# Altium project Service_board.PrjPcb (part 3 of 9)

## Sheet Channel.SchDoc
size A4; DocumentNumber: 3; SheetNumber: 3; SheetTotal: 10
Used 24 times, as channels U_Bank/U_Channel, U_Bank/U_Channel, U_Bank/U_Channel, U_Bank/U_Channel, U_Bank/U_Channel, U_Bank/U_Channel, U_Bank/U_Channel, U_Bank/U_Channel, U_Bank/U_Channel, U_Bank/U_Channel, U_Bank/U_Channel, U_Bank/U_Channel, U_Bank/U_Channel, U_Bank/U_Channel, U_Bank/U_Channel, U_Bank/U_Channel, U_Bank/U_Channel, U_Bank/U_Channel, U_Bank/U_Channel, U_Bank/U_Channel, U_Bank/U_Channel, U_Bank/U_Channel, U_Bank/U_Channel, U_Bank/U_Channel. Parts and nets are listed once, with the designators drawn on the sheet.
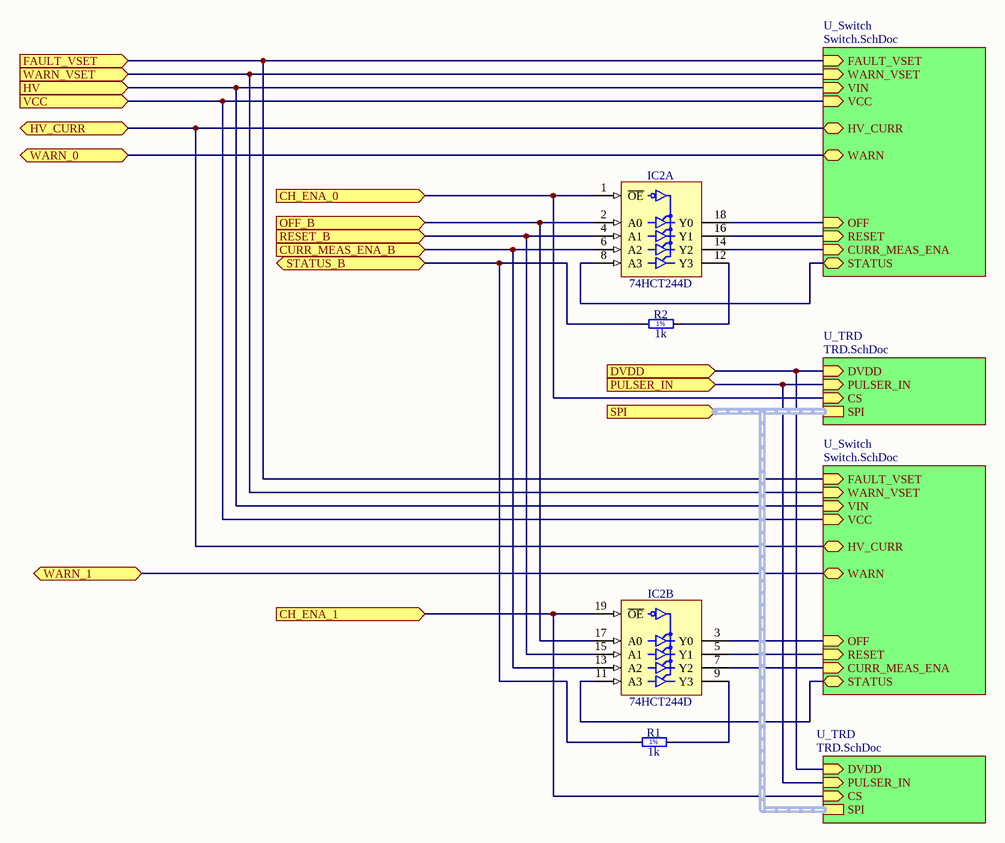
[diagram p5: Channel.SchDoc]

### Parts
IC2  74HCT244D  [SOIC127P1032X265-20N]  (parts A,B of 2)
R1  1k  [RESC2012X60N]
R2  1k  [RESC2012X60N]

### Sub-sheets
U_Switch = Switch.SchDoc: FAULT_VSET (in), WARN_VSET (in), RESET (in), VIN (in), OFF (in), HV_CURR (bidir), CURR_MEAS_ENA (in), VCC (in), WARN (bidir), STATUS (bidir)
U_Switch = Switch.SchDoc: FAULT_VSET (in), WARN_VSET (in), RESET (in), VIN (in), OFF (in), HV_CURR (bidir), CURR_MEAS_ENA (in), VCC (in), WARN (bidir), STATUS (bidir)
U_TRD = TRD.SchDoc: DVDD (in), SPI (harness SPI), CS (in), PULSER_IN (in)
U_TRD = TRD.SchDoc: DVDD (in), SPI (harness SPI), CS (in), PULSER_IN (in)

### Ports
CH_ENA_0 (in), CH_ENA_1 (in), CURR_MEAS_ENA_B (in), DVDD (in), FAULT_VSET (in), HV (in), HV_CURR (bidir), OFF_B (in), PULSER_IN (in), RESET_B (in), SPI (in, harness SPI), STATUS_B (bidir), VCC (in), WARN_0 (bidir), WARN_1 (bidir), WARN_VSET (in)

### Nets
GND: IC2.10(GND)
VCC: IC2.20(VCC)
CH_ENA_0: IC2.1(~{OE}) ; port CH_ENA_0, sheet U_TRD/CS
CH_ENA_1: IC2.19(~{OE}) ; port CH_ENA_1, sheet U_TRD/CS
CURR_MEAS_ENA_B: IC2.6(A2) IC2.13(A2) ; port CURR_MEAS_ENA_B
DVDD: port DVDD, sheet U_TRD/DVDD, sheet U_TRD/DVDD
FAULT_VSET: port FAULT_VSET, sheet U_Switch/FAULT_VSET, sheet U_Switch/FAULT_VSET
HV: port HV, sheet U_Switch/VIN, sheet U_Switch/VIN
HV_CURR: port HV_CURR, sheet U_Switch/HV_CURR, sheet U_Switch/HV_CURR
OFF_B: IC2.2(A0) IC2.17(A0) ; port OFF_B
PULSER_IN: port PULSER_IN, sheet U_TRD/PULSER_IN, sheet U_TRD/PULSER_IN
RESET_B: IC2.4(A1) IC2.15(A1) ; port RESET_B
STATUS_B: R1.1 R2.1 ; port STATUS_B
VCC: port VCC, sheet U_Switch/VCC, sheet U_Switch/VCC  [a separate net that carries the same name]
WARN_0: port WARN_0, sheet U_Switch/WARN
WARN_1: port WARN_1, sheet U_Switch/WARN
WARN_VSET: port WARN_VSET, sheet U_Switch/WARN_VSET, sheet U_Switch/WARN_VSET
NetIC2_3: IC2.3(Y0) ; sheet U_Switch/OFF
NetIC2_5: IC2.5(Y1) ; sheet U_Switch/RESET
NetIC2_7: IC2.7(Y2) ; sheet U_Switch/CURR_MEAS_ENA
NetIC2_8: IC2.8(A3) ; sheet U_Switch/STATUS
NetIC2_9: IC2.9(Y3) R1.2
NetIC2_11: IC2.11(A3) ; sheet U_Switch/STATUS
NetIC2_12: IC2.12(Y3) R2.2
NetIC2_14: IC2.14(Y2) ; sheet U_Switch/CURR_MEAS_ENA
NetIC2_16: IC2.16(Y1) ; sheet U_Switch/RESET
NetIC2_18: IC2.18(Y0) ; sheet U_Switch/OFF

### Channels
U_Bank/U_Channel: designators end in _U_Bank_U_Channel#1; ports CH_ENA_0=NetIC1_U_Bank#1_15 CH_ENA_1=NetIC1_U_Bank#1_1 CURR_MEAS_ENA_B=NetIC2_U_Bank_U_Channel#1_6 DVDD=DVDD FAULT_VSET=NetR37_U_Bank_U_Channel_U_Switch#1_1 HV=NetC?#3_2 HV_CURR=NetIC8_23 OFF_B=NetIC2_U_Bank_U_Channel#1_2 PULSER_IN=NetIC11_5 RESET_B=NetIC2_U_Bank_U_Channel#1_4 STATUS_B=NetIC8_56 VCC=NetC41_U_Bank_U_Channel_U_Switch#1_1 WARN_0=W_A0 WARN_1=W_B0 WARN_VSET=NetR?_U_Bank_U_Channel_U_Switch#3_1
U_Bank/U_Channel: designators end in _U_Bank_U_Channel#2; ports CH_ENA_0=NetIC1_U_Bank#1_2 CH_ENA_1=NetIC1_U_Bank#1_3 CURR_MEAS_ENA_B=NetIC2_U_Bank_U_Channel#1_6 DVDD=DVDD FAULT_VSET=NetR37_U_Bank_U_Channel_U_Switch#1_1 HV=NetC?#3_2 HV_CURR=NetIC8_23 OFF_B=NetIC2_U_Bank_U_Channel#1_2 PULSER_IN=NetIC11_5 RESET_B=NetIC2_U_Bank_U_Channel#1_4 STATUS_B=NetIC8_56 VCC=NetC41_U_Bank_U_Channel_U_Switch#1_1 WARN_0=W_A1 WARN_1=W_B1 WARN_VSET=NetR?_U_Bank_U_Channel_U_Switch#3_1
U_Bank/U_Channel: designators end in _U_Bank_U_Channel#3; ports CH_ENA_0=NetIC1_U_Bank#1_4 CH_ENA_1=NetIC1_U_Bank#1_5 CURR_MEAS_ENA_B=NetIC2_U_Bank_U_Channel#1_6 DVDD=DVDD FAULT_VSET=NetR37_U_Bank_U_Channel_U_Switch#1_1 HV=NetC?#3_2 HV_CURR=NetIC8_23 OFF_B=NetIC2_U_Bank_U_Channel#1_2 PULSER_IN=NetIC11_5 RESET_B=NetIC2_U_Bank_U_Channel#1_4 STATUS_B=NetIC8_56 VCC=NetC41_U_Bank_U_Channel_U_Switch#1_1 WARN_0=W_A2 WARN_1=W_B2 WARN_VSET=NetR?_U_Bank_U_Channel_U_Switch#3_1
U_Bank/U_Channel: designators end in _U_Bank_U_Channel#4; ports CH_ENA_0=NetIC1_U_Bank#1_6 CH_ENA_1=NetIC1_U_Bank#1_7 CURR_MEAS_ENA_B=NetIC2_U_Bank_U_Channel#1_6 DVDD=DVDD FAULT_VSET=NetR37_U_Bank_U_Channel_U_Switch#1_1 HV=NetC?#3_2 HV_CURR=NetIC8_23 OFF_B=NetIC2_U_Bank_U_Channel#1_2 PULSER_IN=NetIC11_5 RESET_B=NetIC2_U_Bank_U_Channel#1_4 STATUS_B=NetIC8_56 VCC=NetC41_U_Bank_U_Channel_U_Switch#1_1 WARN_0=W_A3 WARN_1=W_B3 WARN_VSET=NetR?_U_Bank_U_Channel_U_Switch#3_1
U_Bank/U_Channel: designators end in _U_Bank_U_Channel#5; ports CH_ENA_0=NetIC1_U_Bank#2_15 CH_ENA_1=NetIC1_U_Bank#2_1 CURR_MEAS_ENA_B=NetIC2_U_Bank_U_Channel#1_6 DVDD=DVDD FAULT_VSET=NetR37_U_Bank_U_Channel_U_Switch#1_1 HV=NetC?#3_2 HV_CURR=NetIC8_23 OFF_B=NetIC2_U_Bank_U_Channel#1_2 PULSER_IN=NetIC11_5 RESET_B=NetIC2_U_Bank_U_Channel#1_4 STATUS_B=NetIC8_56 VCC=NetC41_U_Bank_U_Channel_U_Switch#1_1 WARN_0=W_A0 WARN_1=W_B0 WARN_VSET=NetR?_U_Bank_U_Channel_U_Switch#3_1
U_Bank/U_Channel: designators end in _U_Bank_U_Channel#6; ports CH_ENA_0=NetIC1_U_Bank#2_2 CH_ENA_1=NetIC1_U_Bank#2_3 CURR_MEAS_ENA_B=NetIC2_U_Bank_U_Channel#1_6 DVDD=DVDD FAULT_VSET=NetR37_U_Bank_U_Channel_U_Switch#1_1 HV=NetC?#3_2 HV_CURR=NetIC8_23 OFF_B=NetIC2_U_Bank_U_Channel#1_2 PULSER_IN=NetIC11_5 RESET_B=NetIC2_U_Bank_U_Channel#1_4 STATUS_B=NetIC8_56 VCC=NetC41_U_Bank_U_Channel_U_Switch#1_1 WARN_0=W_A1 WARN_1=W_B1 WARN_VSET=NetR?_U_Bank_U_Channel_U_Switch#3_1
U_Bank/U_Channel: designators end in _U_Bank_U_Channel#7; ports CH_ENA_0=NetIC1_U_Bank#2_4 CH_ENA_1=NetIC1_U_Bank#2_5 CURR_MEAS_ENA_B=NetIC2_U_Bank_U_Channel#1_6 DVDD=DVDD FAULT_VSET=NetR37_U_Bank_U_Channel_U_Switch#1_1 HV=NetC?#3_2 HV_CURR=NetIC8_23 OFF_B=NetIC2_U_Bank_U_Channel#1_2 PULSER_IN=NetIC11_5 RESET_B=NetIC2_U_Bank_U_Channel#1_4 STATUS_B=NetIC8_56 VCC=NetC41_U_Bank_U_Channel_U_Switch#1_1 WARN_0=W_A2 WARN_1=W_B2 WARN_VSET=NetR?_U_Bank_U_Channel_U_Switch#3_1
U_Bank/U_Channel: designators end in _U_Bank_U_Channel#8; ports CH_ENA_0=NetIC1_U_Bank#2_6 CH_ENA_1=NetIC1_U_Bank#2_7 CURR_MEAS_ENA_B=NetIC2_U_Bank_U_Channel#1_6 DVDD=DVDD FAULT_VSET=NetR37_U_Bank_U_Channel_U_Switch#1_1 HV=NetC?#3_2 HV_CURR=NetIC8_23 OFF_B=NetIC2_U_Bank_U_Channel#1_2 PULSER_IN=NetIC11_5 RESET_B=NetIC2_U_Bank_U_Channel#1_4 STATUS_B=NetIC8_56 VCC=NetC41_U_Bank_U_Channel_U_Switch#1_1 WARN_0=W_A3 WARN_1=W_B3 WARN_VSET=NetR?_U_Bank_U_Channel_U_Switch#3_1
U_Bank/U_Channel: designators end in _U_Bank_U_Channel#9; ports CH_ENA_0=NetIC1_U_Bank#3_15 CH_ENA_1=NetIC1_U_Bank#3_1 CURR_MEAS_ENA_B=NetIC2_U_Bank_U_Channel#1_6 DVDD=DVDD FAULT_VSET=NetR37_U_Bank_U_Channel_U_Switch#1_1 HV=NetC?#3_2 HV_CURR=NetIC8_23 OFF_B=NetIC2_U_Bank_U_Channel#1_2 PULSER_IN=NetIC11_5 RESET_B=NetIC2_U_Bank_U_Channel#1_4 STATUS_B=NetIC8_56 VCC=NetC41_U_Bank_U_Channel_U_Switch#1_1 WARN_0=W_A0 WARN_1=W_B0 WARN_VSET=NetR?_U_Bank_U_Channel_U_Switch#3_1
U_Bank/U_Channel: designators end in _U_Bank_U_Channel#10; ports CH_ENA_0=NetIC1_U_Bank#3_2 CH_ENA_1=NetIC1_U_Bank#3_3 CURR_MEAS_ENA_B=NetIC2_U_Bank_U_Channel#1_6 DVDD=DVDD FAULT_VSET=NetR37_U_Bank_U_Channel_U_Switch#1_1 HV=NetC?#3_2 HV_CURR=NetIC8_23 OFF_B=NetIC2_U_Bank_U_Channel#1_2 PULSER_IN=NetIC11_5 RESET_B=NetIC2_U_Bank_U_Channel#1_4 STATUS_B=NetIC8_56 VCC=NetC41_U_Bank_U_Channel_U_Switch#1_1 WARN_0=W_A1 WARN_1=W_B1 WARN_VSET=NetR?_U_Bank_U_Channel_U_Switch#3_1
U_Bank/U_Channel: designators end in _U_Bank_U_Channel#11; ports CH_ENA_0=NetIC1_U_Bank#3_4 CH_ENA_1=NetIC1_U_Bank#3_5 CURR_MEAS_ENA_B=NetIC2_U_Bank_U_Channel#1_6 DVDD=DVDD FAULT_VSET=NetR37_U_Bank_U_Channel_U_Switch#1_1 HV=NetC?#3_2 HV_CURR=NetIC8_23 OFF_B=NetIC2_U_Bank_U_Channel#1_2 PULSER_IN=NetIC11_5 RESET_B=NetIC2_U_Bank_U_Channel#1_4 STATUS_B=NetIC8_56 VCC=NetC41_U_Bank_U_Channel_U_Switch#1_1 WARN_0=W_A2 WARN_1=W_B2 WARN_VSET=NetR?_U_Bank_U_Channel_U_Switch#3_1
U_Bank/U_Channel: designators end in _U_Bank_U_Channel#12; ports CH_ENA_0=NetIC1_U_Bank#3_6 CH_ENA_1=NetIC1_U_Bank#3_7 CURR_MEAS_ENA_B=NetIC2_U_Bank_U_Channel#1_6 DVDD=DVDD FAULT_VSET=NetR37_U_Bank_U_Channel_U_Switch#1_1 HV=NetC?#3_2 HV_CURR=NetIC8_23 OFF_B=NetIC2_U_Bank_U_Channel#1_2 PULSER_IN=NetIC11_5 RESET_B=NetIC2_U_Bank_U_Channel#1_4 STATUS_B=NetIC8_56 VCC=NetC41_U_Bank_U_Channel_U_Switch#1_1 WARN_0=W_A3 WARN_1=W_B3 WARN_VSET=NetR?_U_Bank_U_Channel_U_Switch#3_1
U_Bank/U_Channel: designators end in _U_Bank_U_Channel#13; ports CH_ENA_0=NetIC1_U_Bank#4_15 CH_ENA_1=NetIC1_U_Bank#4_1 CURR_MEAS_ENA_B=NetIC2_U_Bank_U_Channel#1_6 DVDD=DVDD FAULT_VSET=NetR37_U_Bank_U_Channel_U_Switch#1_1 HV=NetC?#3_2 HV_CURR=NetIC8_23 OFF_B=NetIC2_U_Bank_U_Channel#1_2 PULSER_IN=NetIC11_5 RESET_B=NetIC2_U_Bank_U_Channel#1_4 STATUS_B=NetIC8_56 VCC=NetC41_U_Bank_U_Channel_U_Switch#1_1 WARN_0=W_A0 WARN_1=W_B0 WARN_VSET=NetR?_U_Bank_U_Channel_U_Switch#3_1
U_Bank/U_Channel: designators end in _U_Bank_U_Channel#14; ports CH_ENA_0=NetIC1_U_Bank#4_2 CH_ENA_1=NetIC1_U_Bank#4_3 CURR_MEAS_ENA_B=NetIC2_U_Bank_U_Channel#1_6 DVDD=DVDD FAULT_VSET=NetR37_U_Bank_U_Channel_U_Switch#1_1 HV=NetC?#3_2 HV_CURR=NetIC8_23 OFF_B=NetIC2_U_Bank_U_Channel#1_2 PULSER_IN=NetIC11_5 RESET_B=NetIC2_U_Bank_U_Channel#1_4 STATUS_B=NetIC8_56 VCC=NetC41_U_Bank_U_Channel_U_Switch#1_1 WARN_0=W_A1 WARN_1=W_B1 WARN_VSET=NetR?_U_Bank_U_Channel_U_Switch#3_1
U_Bank/U_Channel: designators end in _U_Bank_U_Channel#15; ports CH_ENA_0=NetIC1_U_Bank#4_4 CH_ENA_1=NetIC1_U_Bank#4_5 CURR_MEAS_ENA_B=NetIC2_U_Bank_U_Channel#1_6 DVDD=DVDD FAULT_VSET=NetR37_U_Bank_U_Channel_U_Switch#1_1 HV=NetC?#3_2 HV_CURR=NetIC8_23 OFF_B=NetIC2_U_Bank_U_Channel#1_2 PULSER_IN=NetIC11_5 RESET_B=NetIC2_U_Bank_U_Channel#1_4 STATUS_B=NetIC8_56 VCC=NetC41_U_Bank_U_Channel_U_Switch#1_1 WARN_0=W_A2 WARN_1=W_B2 WARN_VSET=NetR?_U_Bank_U_Channel_U_Switch#3_1
U_Bank/U_Channel: designators end in _U_Bank_U_Channel#16; ports CH_ENA_0=NetIC1_U_Bank#4_6 CH_ENA_1=NetIC1_U_Bank#4_7 CURR_MEAS_ENA_B=NetIC2_U_Bank_U_Channel#1_6 DVDD=DVDD FAULT_VSET=NetR37_U_Bank_U_Channel_U_Switch#1_1 HV=NetC?#3_2 HV_CURR=NetIC8_23 OFF_B=NetIC2_U_Bank_U_Channel#1_2 PULSER_IN=NetIC11_5 RESET_B=NetIC2_U_Bank_U_Channel#1_4 STATUS_B=NetIC8_56 VCC=NetC41_U_Bank_U_Channel_U_Switch#1_1 WARN_0=W_A3 WARN_1=W_B3 WARN_VSET=NetR?_U_Bank_U_Channel_U_Switch#3_1
U_Bank/U_Channel: designators end in _U_Bank_U_Channel#17; ports CH_ENA_0=NetIC1_U_Bank#5_15 CH_ENA_1=NetIC1_U_Bank#5_1 CURR_MEAS_ENA_B=NetIC2_U_Bank_U_Channel#1_6 DVDD=DVDD FAULT_VSET=NetR37_U_Bank_U_Channel_U_Switch#1_1 HV=NetC?#3_2 HV_CURR=NetIC8_23 OFF_B=NetIC2_U_Bank_U_Channel#1_2 PULSER_IN=NetIC11_5 RESET_B=NetIC2_U_Bank_U_Channel#1_4 STATUS_B=NetIC8_56 VCC=NetC41_U_Bank_U_Channel_U_Switch#1_1 WARN_0=W_A0 WARN_1=W_B0 WARN_VSET=NetR?_U_Bank_U_Channel_U_Switch#3_1
U_Bank/U_Channel: designators end in _U_Bank_U_Channel#18; ports CH_ENA_0=NetIC1_U_Bank#5_2 CH_ENA_1=NetIC1_U_Bank#5_3 CURR_MEAS_ENA_B=NetIC2_U_Bank_U_Channel#1_6 DVDD=DVDD FAULT_VSET=NetR37_U_Bank_U_Channel_U_Switch#1_1 HV=NetC?#3_2 HV_CURR=NetIC8_23 OFF_B=NetIC2_U_Bank_U_Channel#1_2 PULSER_IN=NetIC11_5 RESET_B=NetIC2_U_Bank_U_Channel#1_4 STATUS_B=NetIC8_56 VCC=NetC41_U_Bank_U_Channel_U_Switch#1_1 WARN_0=W_A1 WARN_1=W_B1 WARN_VSET=NetR?_U_Bank_U_Channel_U_Switch#3_1
U_Bank/U_Channel: designators end in _U_Bank_U_Channel#19; ports CH_ENA_0=NetIC1_U_Bank#5_4 CH_ENA_1=NetIC1_U_Bank#5_5 CURR_MEAS_ENA_B=NetIC2_U_Bank_U_Channel#1_6 DVDD=DVDD FAULT_VSET=NetR37_U_Bank_U_Channel_U_Switch#1_1 HV=NetC?#3_2 HV_CURR=NetIC8_23 OFF_B=NetIC2_U_Bank_U_Channel#1_2 PULSER_IN=NetIC11_5 RESET_B=NetIC2_U_Bank_U_Channel#1_4 STATUS_B=NetIC8_56 VCC=NetC41_U_Bank_U_Channel_U_Switch#1_1 WARN_0=W_A2 WARN_1=W_B2 WARN_VSET=NetR?_U_Bank_U_Channel_U_Switch#3_1
U_Bank/U_Channel: designators end in _U_Bank_U_Channel#20; ports CH_ENA_0=NetIC1_U_Bank#5_6 CH_ENA_1=NetIC1_U_Bank#5_7 CURR_MEAS_ENA_B=NetIC2_U_Bank_U_Channel#1_6 DVDD=DVDD FAULT_VSET=NetR37_U_Bank_U_Channel_U_Switch#1_1 HV=NetC?#3_2 HV_CURR=NetIC8_23 OFF_B=NetIC2_U_Bank_U_Channel#1_2 PULSER_IN=NetIC11_5 RESET_B=NetIC2_U_Bank_U_Channel#1_4 STATUS_B=NetIC8_56 VCC=NetC41_U_Bank_U_Channel_U_Switch#1_1 WARN_0=W_A3 WARN_1=W_B3 WARN_VSET=NetR?_U_Bank_U_Channel_U_Switch#3_1
U_Bank/U_Channel: designators end in _U_Bank_U_Channel#21; ports CH_ENA_0=NetIC1_U_Bank#6_15 CH_ENA_1=NetIC1_U_Bank#6_1 CURR_MEAS_ENA_B=NetIC2_U_Bank_U_Channel#1_6 DVDD=DVDD FAULT_VSET=NetR37_U_Bank_U_Channel_U_Switch#1_1 HV=NetC?#3_2 HV_CURR=NetIC8_23 OFF_B=NetIC2_U_Bank_U_Channel#1_2 PULSER_IN=NetIC11_5 RESET_B=NetIC2_U_Bank_U_Channel#1_4 STATUS_B=NetIC8_56 VCC=NetC41_U_Bank_U_Channel_U_Switch#1_1 WARN_0=W_A0 WARN_1=W_B0 WARN_VSET=NetR?_U_Bank_U_Channel_U_Switch#3_1
U_Bank/U_Channel: designators end in _U_Bank_U_Channel#22; ports CH_ENA_0=NetIC1_U_Bank#6_2 CH_ENA_1=NetIC1_U_Bank#6_3 CURR_MEAS_ENA_B=NetIC2_U_Bank_U_Channel#1_6 DVDD=DVDD FAULT_VSET=NetR37_U_Bank_U_Channel_U_Switch#1_1 HV=NetC?#3_2 HV_CURR=NetIC8_23 OFF_B=NetIC2_U_Bank_U_Channel#1_2 PULSER_IN=NetIC11_5 RESET_B=NetIC2_U_Bank_U_Channel#1_4 STATUS_B=NetIC8_56 VCC=NetC41_U_Bank_U_Channel_U_Switch#1_1 WARN_0=W_A1 WARN_1=W_B1 WARN_VSET=NetR?_U_Bank_U_Channel_U_Switch#3_1
U_Bank/U_Channel: designators end in _U_Bank_U_Channel#23; ports CH_ENA_0=NetIC1_U_Bank#6_4 CH_ENA_1=NetIC1_U_Bank#6_5 CURR_MEAS_ENA_B=NetIC2_U_Bank_U_Channel#1_6 DVDD=DVDD FAULT_VSET=NetR37_U_Bank_U_Channel_U_Switch#1_1 HV=NetC?#3_2 HV_CURR=NetIC8_23 OFF_B=NetIC2_U_Bank_U_Channel#1_2 PULSER_IN=NetIC11_5 RESET_B=NetIC2_U_Bank_U_Channel#1_4 STATUS_B=NetIC8_56 VCC=NetC41_U_Bank_U_Channel_U_Switch#1_1 WARN_0=W_A2 WARN_1=W_B2 WARN_VSET=NetR?_U_Bank_U_Channel_U_Switch#3_1
U_Bank/U_Channel: designators end in _U_Bank_U_Channel#24; ports CH_ENA_0=NetIC1_U_Bank#6_6 CH_ENA_1=NetIC1_U_Bank#6_7 CURR_MEAS_ENA_B=NetIC2_U_Bank_U_Channel#1_6 DVDD=DVDD FAULT_VSET=NetR37_U_Bank_U_Channel_U_Switch#1_1 HV=NetC?#3_2 HV_CURR=NetIC8_23 OFF_B=NetIC2_U_Bank_U_Channel#1_2 PULSER_IN=NetIC11_5 RESET_B=NetIC2_U_Bank_U_Channel#1_4 STATUS_B=NetIC8_56 VCC=NetC41_U_Bank_U_Channel_U_Switch#1_1 WARN_0=W_A3 WARN_1=W_B3 WARN_VSET=NetR?_U_Bank_U_Channel_U_Switch#3_1

### Buses and harness runs
harness port SPI = sheet U_TRD/SPI

### Notes on the sheet
- (in symbol R0805_1K_1%_0.33W_100PPM_VISHAY_CRCW-HP) 1%

### Library data of the parts
IC2 = 74HCT244D: Octal Buffer And Line Driver with 3-State Ouputs; Part Description: Octal Buffer/Line Driver with 3-State Outputs; Manufacturer: NXP SEMICONDUCTORS; PressFit: No; Bonding: No; Part Number: 74HCT244D; Component Kind: Standard; Component Type: Standard; Device: 74HCT244D; PackageDescription: SOIC, 1.27mm pitch; 20 pin, 7.50mm W X 12.80mm L X 2.65mm H body, IPC Medium Density; Manufacturer Part Number: 74HCT244D; Pin Count: 20; Case: SOIC20; Mounted: Yes; Socket: No; SMD: Yes; Sense: No; ComponentHeight: 2.65mm; Author: CERN DEM JLC; HelpURL: \\cern.ch\dfs\Applications\Altium\Datasheets\74HCT244D.pdf; CreateDate: 27.08.2013; LatestRevisionDate: 27.08.2013
R1 R2 = R0805_1K_1%_0.33W_100PPM_VISHAY_CRCW-HP: Resistor - 1%; Part Description: 150V, Pulse Proof, High Power Thick Film Chip Resistor; Manufacturer: VISHAY DRALORIC; Manufacturer Part Number: CRCW08051K00FKEAHP; Power: 0.33W; TC: ±100ppm/°C; PressFit: No; Part Number: R0805_1K_1%_0.33W_100PPM_VISHAY_CRCW-HP; Component Kind: Standard; Component Type: Standard; Pin Count: 2; Value: 1k; Status: None; Tolerance: ±1%; Case: 0805; Mounted: Yes; Sense: No; Socket: No; SMD: Yes; Manufacturer1 ComponentHeight: 0.6mm; HelpURL: \\cern.ch\dfs\Applications\Altium\Datasheets\R0805_VISHAY_CRCW-HP e3.pdf; Author: CERN DEM JLC; CreateDate: 16.06.2010; LatestRevisionDate: 16.06.2010

## Sheet TRD.SchDoc
size A4; DocumentNumber: 10; SheetNumber: 10; SheetTotal: 10
Used 48 times, as channels U_Bank/U_Channel/U_TRD, U_Bank/U_Channel/U_TRD, U_Bank/U_Channel/U_TRD, U_Bank/U_Channel/U_TRD, U_Bank/U_Channel/U_TRD, U_Bank/U_Channel/U_TRD, U_Bank/U_Channel/U_TRD, U_Bank/U_Channel/U_TRD, U_Bank/U_Channel/U_TRD, U_Bank/U_Channel/U_TRD, U_Bank/U_Channel/U_TRD, U_Bank/U_Channel/U_TRD, U_Bank/U_Channel/U_TRD, U_Bank/U_Channel/U_TRD, U_Bank/U_Channel/U_TRD, U_Bank/U_Channel/U_TRD, U_Bank/U_Channel/U_TRD, U_Bank/U_Channel/U_TRD, U_Bank/U_Channel/U_TRD, U_Bank/U_Channel/U_TRD, U_Bank/U_Channel/U_TRD, U_Bank/U_Channel/U_TRD, U_Bank/U_Channel/U_TRD, U_Bank/U_Channel/U_TRD, U_Bank/U_Channel/U_TRD, U_Bank/U_Channel/U_TRD, U_Bank/U_Channel/U_TRD, U_Bank/U_Channel/U_TRD, U_Bank/U_Channel/U_TRD, U_Bank/U_Channel/U_TRD, U_Bank/U_Channel/U_TRD, U_Bank/U_Channel/U_TRD, U_Bank/U_Channel/U_TRD, U_Bank/U_Channel/U_TRD, U_Bank/U_Channel/U_TRD, U_Bank/U_Channel/U_TRD, U_Bank/U_Channel/U_TRD, U_Bank/U_Channel/U_TRD, U_Bank/U_Channel/U_TRD, U_Bank/U_Channel/U_TRD, U_Bank/U_Channel/U_TRD, U_Bank/U_Channel/U_TRD, U_Bank/U_Channel/U_TRD, U_Bank/U_Channel/U_TRD, U_Bank/U_Channel/U_TRD, U_Bank/U_Channel/U_TRD, U_Bank/U_Channel/U_TRD, U_Bank/U_Channel/U_TRD. Parts and nets are listed once, with the designators drawn on the sheet.
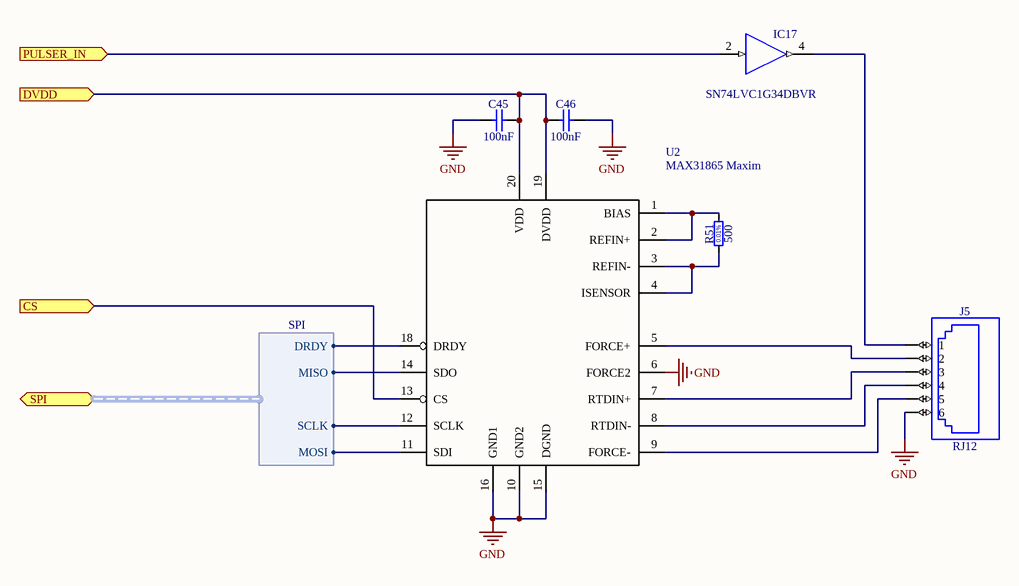
[diagram p6: TRD.SchDoc]

### Parts
C45  100nF  [CAPC3216X140N]
C46  100nF  [CAPC3216X140N]
IC17  SN74LVC1G34DBVR  [SOT95P280X145-5N]
J5  RJ12  [WURTH_615006138521]
R51  500  [RESC2013X64N]
U2  MAX31865 Maxim

### Ports
CS (in), DVDD (in), PULSER_IN (in), SPI (bidir, harness SPI)

### Harnesses
SPI: DRDY, MISO, SCLK, MOSI

### Nets
GND: C45.1 C46.2 IC17.3(GND) J5.6 U2.6(FORCE2) U2.10(GND2) U2.15(DGND) U2.16(GND1)
VDD: IC17.5(VCC)
CS: U2.13(CS) ; port CS
DVDD: C45.2 C46.1 U2.19(DVDD) U2.20(VDD) ; port DVDD
PULSER_IN: IC17.2(IN) ; port PULSER_IN
NetIC17_4: IC17.4(OUT) J5.1
NetJ5_2: J5.2 U2.5(FORCE+)
NetJ5_3: J5.3 U2.7(RTDIN+)
NetJ5_4: J5.4 U2.8(RTDIN-)
NetJ5_5: J5.5 U2.9(FORCE-)
NetR51_1: R51.1 U2.3(REFIN-) U2.4(ISENSOR)
NetR51_2: R51.2 U2.1(BIAS) U2.2(REFIN+)
NetU2_11: U2.11(SDI) ; port SPI.MOSI
NetU2_12: U2.12(SCLK) ; port SPI.SCLK
NetU2_14: U2.14(SDO) ; port SPI.MISO
NetU2_18: U2.18(DRDY) ; port SPI.DRDY

Not connected (* = marked no-connect by the designer): U2 17

### Channels
U_Bank/U_Channel/U_TRD: designators end in _U_Bank_U_Channel_U_TRD#1; ports CS=NetIC1_U_Bank#1_15 DVDD=DVDD PULSER_IN=NetIC11_5
U_Bank/U_Channel/U_TRD: designators end in _U_Bank_U_Channel_U_TRD#2; ports CS=NetIC1_U_Bank#1_1 DVDD=DVDD PULSER_IN=NetIC11_5
U_Bank/U_Channel/U_TRD: designators end in _U_Bank_U_Channel_U_TRD#3; ports CS=NetIC1_U_Bank#1_2 DVDD=DVDD PULSER_IN=NetIC11_5
U_Bank/U_Channel/U_TRD: designators end in _U_Bank_U_Channel_U_TRD#4; ports CS=NetIC1_U_Bank#1_3 DVDD=DVDD PULSER_IN=NetIC11_5
U_Bank/U_Channel/U_TRD: designators end in _U_Bank_U_Channel_U_TRD#5; ports CS=NetIC1_U_Bank#1_4 DVDD=DVDD PULSER_IN=NetIC11_5
U_Bank/U_Channel/U_TRD: designators end in _U_Bank_U_Channel_U_TRD#6; ports CS=NetIC1_U_Bank#1_5 DVDD=DVDD PULSER_IN=NetIC11_5
U_Bank/U_Channel/U_TRD: designators end in _U_Bank_U_Channel_U_TRD#7; ports CS=NetIC1_U_Bank#1_6 DVDD=DVDD PULSER_IN=NetIC11_5
U_Bank/U_Channel/U_TRD: designators end in _U_Bank_U_Channel_U_TRD#8; ports CS=NetIC1_U_Bank#1_7 DVDD=DVDD PULSER_IN=NetIC11_5
U_Bank/U_Channel/U_TRD: designators end in _U_Bank_U_Channel_U_TRD#9; ports CS=NetIC1_U_Bank#2_15 DVDD=DVDD PULSER_IN=NetIC11_5
U_Bank/U_Channel/U_TRD: designators end in _U_Bank_U_Channel_U_TRD#10; ports CS=NetIC1_U_Bank#2_1 DVDD=DVDD PULSER_IN=NetIC11_5
U_Bank/U_Channel/U_TRD: designators end in _U_Bank_U_Channel_U_TRD#11; ports CS=NetIC1_U_Bank#2_2 DVDD=DVDD PULSER_IN=NetIC11_5
U_Bank/U_Channel/U_TRD: designators end in _U_Bank_U_Channel_U_TRD#12; ports CS=NetIC1_U_Bank#2_3 DVDD=DVDD PULSER_IN=NetIC11_5
U_Bank/U_Channel/U_TRD: designators end in _U_Bank_U_Channel_U_TRD#13; ports CS=NetIC1_U_Bank#2_4 DVDD=DVDD PULSER_IN=NetIC11_5
U_Bank/U_Channel/U_TRD: designators end in _U_Bank_U_Channel_U_TRD#14; ports CS=NetIC1_U_Bank#2_5 DVDD=DVDD PULSER_IN=NetIC11_5
U_Bank/U_Channel/U_TRD: designators end in _U_Bank_U_Channel_U_TRD#15; ports CS=NetIC1_U_Bank#2_6 DVDD=DVDD PULSER_IN=NetIC11_5
U_Bank/U_Channel/U_TRD: designators end in _U_Bank_U_Channel_U_TRD#16; ports CS=NetIC1_U_Bank#2_7 DVDD=DVDD PULSER_IN=NetIC11_5
U_Bank/U_Channel/U_TRD: designators end in _U_Bank_U_Channel_U_TRD#17; ports CS=NetIC1_U_Bank#3_15 DVDD=DVDD PULSER_IN=NetIC11_5
U_Bank/U_Channel/U_TRD: designators end in _U_Bank_U_Channel_U_TRD#18; ports CS=NetIC1_U_Bank#3_1 DVDD=DVDD PULSER_IN=NetIC11_5
U_Bank/U_Channel/U_TRD: designators end in _U_Bank_U_Channel_U_TRD#19; ports CS=NetIC1_U_Bank#3_2 DVDD=DVDD PULSER_IN=NetIC11_5
U_Bank/U_Channel/U_TRD: designators end in _U_Bank_U_Channel_U_TRD#20; ports CS=NetIC1_U_Bank#3_3 DVDD=DVDD PULSER_IN=NetIC11_5
U_Bank/U_Channel/U_TRD: designators end in _U_Bank_U_Channel_U_TRD#21; ports CS=NetIC1_U_Bank#3_4 DVDD=DVDD PULSER_IN=NetIC11_5
U_Bank/U_Channel/U_TRD: designators end in _U_Bank_U_Channel_U_TRD#22; ports CS=NetIC1_U_Bank#3_5 DVDD=DVDD PULSER_IN=NetIC11_5
U_Bank/U_Channel/U_TRD: designators end in _U_Bank_U_Channel_U_TRD#23; ports CS=NetIC1_U_Bank#3_6 DVDD=DVDD PULSER_IN=NetIC11_5
U_Bank/U_Channel/U_TRD: designators end in _U_Bank_U_Channel_U_TRD#24; ports CS=NetIC1_U_Bank#3_7 DVDD=DVDD PULSER_IN=NetIC11_5
U_Bank/U_Channel/U_TRD: designators end in _U_Bank_U_Channel_U_TRD#25; ports CS=NetIC1_U_Bank#4_15 DVDD=DVDD PULSER_IN=NetIC11_5
U_Bank/U_Channel/U_TRD: designators end in _U_Bank_U_Channel_U_TRD#26; ports CS=NetIC1_U_Bank#4_1 DVDD=DVDD PULSER_IN=NetIC11_5
U_Bank/U_Channel/U_TRD: designators end in _U_Bank_U_Channel_U_TRD#27; ports CS=NetIC1_U_Bank#4_2 DVDD=DVDD PULSER_IN=NetIC11_5
U_Bank/U_Channel/U_TRD: designators end in _U_Bank_U_Channel_U_TRD#28; ports CS=NetIC1_U_Bank#4_3 DVDD=DVDD PULSER_IN=NetIC11_5
U_Bank/U_Channel/U_TRD: designators end in _U_Bank_U_Channel_U_TRD#29; ports CS=NetIC1_U_Bank#4_4 DVDD=DVDD PULSER_IN=NetIC11_5
U_Bank/U_Channel/U_TRD: designators end in _U_Bank_U_Channel_U_TRD#30; ports CS=NetIC1_U_Bank#4_5 DVDD=DVDD PULSER_IN=NetIC11_5
U_Bank/U_Channel/U_TRD: designators end in _U_Bank_U_Channel_U_TRD#31; ports CS=NetIC1_U_Bank#4_6 DVDD=DVDD PULSER_IN=NetIC11_5
U_Bank/U_Channel/U_TRD: designators end in _U_Bank_U_Channel_U_TRD#32; ports CS=NetIC1_U_Bank#4_7 DVDD=DVDD PULSER_IN=NetIC11_5
U_Bank/U_Channel/U_TRD: designators end in _U_Bank_U_Channel_U_TRD#33; ports CS=NetIC1_U_Bank#5_15 DVDD=DVDD PULSER_IN=NetIC11_5
U_Bank/U_Channel/U_TRD: designators end in _U_Bank_U_Channel_U_TRD#34; ports CS=NetIC1_U_Bank#5_1 DVDD=DVDD PULSER_IN=NetIC11_5
U_Bank/U_Channel/U_TRD: designators end in _U_Bank_U_Channel_U_TRD#35; ports CS=NetIC1_U_Bank#5_2 DVDD=DVDD PULSER_IN=NetIC11_5
U_Bank/U_Channel/U_TRD: designators end in _U_Bank_U_Channel_U_TRD#36; ports CS=NetIC1_U_Bank#5_3 DVDD=DVDD PULSER_IN=NetIC11_5
U_Bank/U_Channel/U_TRD: designators end in _U_Bank_U_Channel_U_TRD#37; ports CS=NetIC1_U_Bank#5_4 DVDD=DVDD PULSER_IN=NetIC11_5
U_Bank/U_Channel/U_TRD: designators end in _U_Bank_U_Channel_U_TRD#38; ports CS=NetIC1_U_Bank#5_5 DVDD=DVDD PULSER_IN=NetIC11_5
U_Bank/U_Channel/U_TRD: designators end in _U_Bank_U_Channel_U_TRD#39; ports CS=NetIC1_U_Bank#5_6 DVDD=DVDD PULSER_IN=NetIC11_5
U_Bank/U_Channel/U_TRD: designators end in _U_Bank_U_Channel_U_TRD#40; ports CS=NetIC1_U_Bank#5_7 DVDD=DVDD PULSER_IN=NetIC11_5
U_Bank/U_Channel/U_TRD: designators end in _U_Bank_U_Channel_U_TRD#41; ports CS=NetIC1_U_Bank#6_15 DVDD=DVDD PULSER_IN=NetIC11_5
U_Bank/U_Channel/U_TRD: designators end in _U_Bank_U_Channel_U_TRD#42; ports CS=NetIC1_U_Bank#6_1 DVDD=DVDD PULSER_IN=NetIC11_5
U_Bank/U_Channel/U_TRD: designators end in _U_Bank_U_Channel_U_TRD#43; ports CS=NetIC1_U_Bank#6_2 DVDD=DVDD PULSER_IN=NetIC11_5
U_Bank/U_Channel/U_TRD: designators end in _U_Bank_U_Channel_U_TRD#44; ports CS=NetIC1_U_Bank#6_3 DVDD=DVDD PULSER_IN=NetIC11_5
U_Bank/U_Channel/U_TRD: designators end in _U_Bank_U_Channel_U_TRD#45; ports CS=NetIC1_U_Bank#6_4 DVDD=DVDD PULSER_IN=NetIC11_5
U_Bank/U_Channel/U_TRD: designators end in _U_Bank_U_Channel_U_TRD#46; ports CS=NetIC1_U_Bank#6_5 DVDD=DVDD PULSER_IN=NetIC11_5
U_Bank/U_Channel/U_TRD: designators end in _U_Bank_U_Channel_U_TRD#47; ports CS=NetIC1_U_Bank#6_6 DVDD=DVDD PULSER_IN=NetIC11_5
U_Bank/U_Channel/U_TRD: designators end in _U_Bank_U_Channel_U_TRD#48; ports CS=NetIC1_U_Bank#6_7 DVDD=DVDD PULSER_IN=NetIC11_5

### Notes on the sheet
- (in symbol R0805_500R_0.01%_0.2W_0.2PPM_VISHAY_VSMP) 0.01%

### Library data of the parts
C45 C46 = CC1206_100NF_100V_10%_X7R: Non-polarised capacitor; Part Description: SMD Multilayer Chip Ceramic Capacitor; Manufacturer: GENERIC; Manufacturer1 Part Number: 222260115649; Voltage: 100V; TC: X7R; Tolerance: ±10%; Part Number: CC1206_100NF_100V_10%_X7R; Component Kind: Standard; Component Type: Standard; Pin Count: 2; Value: 100nF; Status: Preferred; Manufacturer Part Number: CC1206_100NF_100V_10%_X7R; Case: 1206; Mounted: Yes; Socket: No; SMD: Yes; Sense: No; Manufacturer1 Example: PHYCOMP; Manufacturer1 ComponentHeight: 1.25mm; HelpURL: \\cern.ch\dfs\Applications\Altium\Datasheets\CC1206_X7R_PHYCOMP.pdf; Author: CERN DEM JLC; CreateDate: 24.08.2009; LatestRevisionDate: 24.08.2009
IC17 = SN74LVC1G34DBVR: Single Buffer Gate; Manufacturer: TEXAS INSTRUMENTS; PressFit: No; Bonding: No; Part Number: SN74LVC1G34DBVR; Component Kind: Standard; Component Type: Standard; Device: SN74LVC1G34DBVR; PackageDescription: SOT, 0.95mm pitch; 5 pin, 1.60mm W X 2.90mm L X 1.45mm H body, IPC Medium Density; Part Description: Single Buffer Gate; Manufacturer Part Number: SN74LVC1G34DBVR; Pin Count: 5; Case: SOT23-5; Mounted: Yes; Socket: No; SMD: Yes; Sense: No; ComponentHeight: 1.45mm; Author: CERN DEM JLC; HelpURL: \\cern.ch\dfs\Applications\Altium\Datasheets\SN74LVC1G34DBVR.pdf; CreateDate: 20.01.2014; LatestRevisionDate: 20.01.2014
J5 = WURTH_615006138521: Connector RJ12 (6P6C); Part Description: 1 Port RJ12 Connector, 6P6C,  Straight With Ears; Manufacturer: WURTH ELEKTRONIK; PressFit: No; Part Number: WURTH_615006138521; Component Kind: Standard; Component Type: Standard; Pin Count: 6; Family: RJ12; Mounted: Yes; Socket: No; SMD: No; Sense: No; Status: None; Manufacturer Part Number: 615006138521; ComponentHeight: 16.15mm; HelpURL: \\cern.ch\dfs\Applications\Altium\Datasheets\WURTH_615006138521.pdf; Author: CERN DEM MR; CreateDate: 15.03.2016; LatestRevisionDate: 15.03.2016
R51 = R0805_500R_0.01%_0.2W_0.2PPM_VISHAY_VSMP: Resistor - 0.01%; Part Description: Ultra High Precision Foil Wraparound Surface Mount Chip Resistor; Manufacturer: VISHAY PRECISION; Manufacturer Part Number: Y1624500R000T9R; Power: 0.2W; TC: ±0.2ppm/°C; PressFit: No; Part Number: R0805_500R_0.01%_0.2W_0.2PPM_VISHAY_VSMP; Component Kind: Standard; Component Type: Standard; Pin Count: 2; Value: 500; Status: None; Tolerance: ±0.01%; Case: 0805; Mounted: Yes; Sense: No; Socket: No; SMD: Yes; Manufacturer1 ComponentHeight: 0.64mm; HelpURL: \\cern.ch\dfs\Applications\Altium\Datasheets\R0805_VISHAY_VSMP.pdf; Author: CERN DEM JLC; CreateDate: 22.09.2011; LatestRevisionDate: 22.09.2011
U2 = MAX31865: Name: MAX31865; Manufacturer: Maxim

## Sheet Switch.SchDoc
size A4; DocumentNumber: 9; SheetNumber: 9; SheetTotal: 10
Used 48 times, as channels U_Bank/U_Channel/U_Switch, U_Bank/U_Channel/U_Switch, U_Bank/U_Channel/U_Switch, U_Bank/U_Channel/U_Switch, U_Bank/U_Channel/U_Switch, U_Bank/U_Channel/U_Switch, U_Bank/U_Channel/U_Switch, U_Bank/U_Channel/U_Switch, U_Bank/U_Channel/U_Switch, U_Bank/U_Channel/U_Switch, U_Bank/U_Channel/U_Switch, U_Bank/U_Channel/U_Switch, U_Bank/U_Channel/U_Switch, U_Bank/U_Channel/U_Switch, U_Bank/U_Channel/U_Switch, U_Bank/U_Channel/U_Switch, U_Bank/U_Channel/U_Switch, U_Bank/U_Channel/U_Switch, U_Bank/U_Channel/U_Switch, U_Bank/U_Channel/U_Switch, U_Bank/U_Channel/U_Switch, U_Bank/U_Channel/U_Switch, U_Bank/U_Channel/U_Switch, U_Bank/U_Channel/U_Switch, U_Bank/U_Channel/U_Switch, U_Bank/U_Channel/U_Switch, U_Bank/U_Channel/U_Switch, U_Bank/U_Channel/U_Switch, U_Bank/U_Channel/U_Switch, U_Bank/U_Channel/U_Switch, U_Bank/U_Channel/U_Switch, U_Bank/U_Channel/U_Switch, U_Bank/U_Channel/U_Switch, U_Bank/U_Channel/U_Switch, U_Bank/U_Channel/U_Switch, U_Bank/U_Channel/U_Switch, U_Bank/U_Channel/U_Switch, U_Bank/U_Channel/U_Switch, U_Bank/U_Channel/U_Switch, U_Bank/U_Channel/U_Switch, U_Bank/U_Channel/U_Switch, U_Bank/U_Channel/U_Switch, U_Bank/U_Channel/U_Switch, U_Bank/U_Channel/U_Switch, U_Bank/U_Channel/U_Switch, U_Bank/U_Channel/U_Switch, U_Bank/U_Channel/U_Switch, U_Bank/U_Channel/U_Switch. Parts and nets are listed once, with the designators drawn on the sheet.
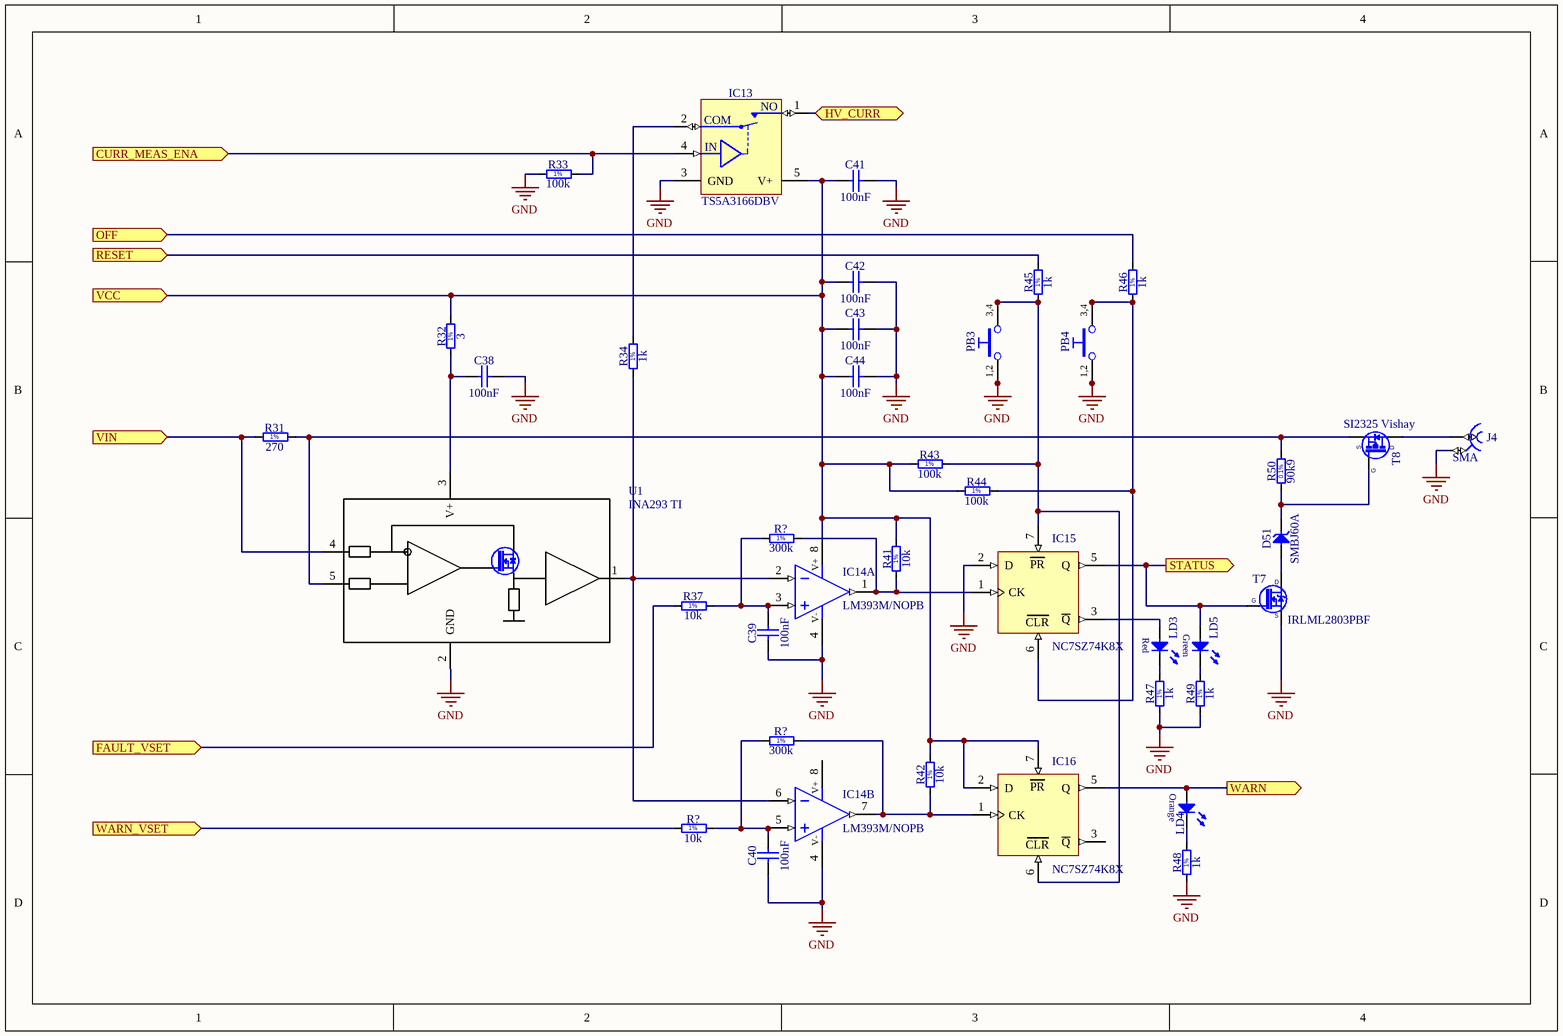
[diagram p7: Switch.SchDoc]

### Parts
(Parts that share a designator on the sheet are numbered #1, #2 ... from top to bottom, then left to right.)
C38  100nF  [CAPC2012X135N]
C39  100nF  [CAPC2012X135N]
C40  100nF  [CAPC2012X135N]
C41  100nF  [CAPC2012X135N]
C42  100nF  [CAPC2012X135N]
C43  100nF  [CAPC2012X135N]
C44  100nF  [CAPC2012X135N]
D51  SMBJ60A  [DIOM5336X265N]
IC13  TS5A3166DBV  [SOT95P280X145-5N]
IC14  LM393M/NOPB  [SOIC127P600X175-8N]  (parts A,B of 2)
IC15  NC7SZ74K8X  [SOP50P310X90-8N]
IC16  NC7SZ74K8X  [SOP50P310X90-8N]
J4  SMA  [AMPHENOL_132134]
LD3  Super Red  [LED_OSRAM_LSR976]  (value not drawn)
LD4  Orange  [LED_OSRAM_LOR976]  (value not drawn)
LD5  Green  [LED_OSRAM_LGR971]  (value not drawn)
PB3  Push Button  [PB_OMRON_B3F-1000]  (value not drawn)
PB4  Push Button  [PB_OMRON_B3F-1000]  (value not drawn)
R31  270  [RESC2012X60N]
R32  3  [RESC2012X60N]
R33  100k  [RESC2012X60N]
R34  1k  [RESC2012X60N]
R37  10k  [RESC2012X60N]
R41  10k  [RESC2012X60N]
R42  10k  [RESC2012X60N]
R43  100k  [RESC2012X60N]
R44  100k  [RESC2012X60N]
R45  1k  [RESC2012X60N]
R46  1k  [RESC2012X60N]
R47  1k  [RESC2012X60N]
R48  1k  [RESC2012X60N]
R49  1k  [RESC2012X60N]
R50  90k9  [RESC2012X60N]
R?#1  300k  [RESC2012X60N]
R?#2  300k  [RESC2012X60N]
R?#3  10k  [RESC2012X60N]
T7  IRLML2803PBF  [SOT95P237X112-3N]
T8  SI2325 Vishay  [SOT95P230X112-3N]
U1  INA293 TI  [SOT95P280X110-5N]

### Ports
CURR_MEAS_ENA (in), FAULT_VSET (in), HV_CURR (bidir), OFF (in), RESET (in), STATUS (out), VCC (in), VIN (in), WARN (out), WARN_VSET (in)

### Nets
GND: C38.2 C39.1 C40.1 C41.2 C42.2 C43.2 C44.2 IC13.3(GND) IC14.4(V-) IC15.2(D) J4.2 PB3.1 PB3.2 PB4.1 PB4.2 R33.1 R47.1 R48.1 R49.1 T7.2(S) U1.2(GND)
CURR_MEAS_ENA: IC13.4(IN) R33.2 ; port CURR_MEAS_ENA
FAULT_VSET: R37.1 ; port FAULT_VSET
HV_CURR: IC13.1(NO) ; port HV_CURR
OFF: R46.2 ; port OFF
RESET: R45.2 ; port RESET
STATUS: IC15.5(Q) LD5.2(A) T7.1(G) ; port STATUS
VCC: C41.1 C42.1 C43.1 C44.1 IC13.5(V+) IC14.1(OUT) IC14.8(V+) IC15.1(CK) IC16.2(D) IC16.7(~{PR}) R32.2 R41.1 R41.2 R42.2 R43.1 R44.1 R?#1.2 ; port VCC
VIN: R31.1 U1.4(VIN-) ; port VIN
WARN: IC16.5(Q) LD4.2(A) ; port WARN
WARN_VSET: R?#3.1 ; port WARN_VSET
NetC38_1: C38.1 R32.1 U1.3(V+)
NetC39_2: C39.2 IC14.3(IN+) R37.2 R?#1.1
NetC40_2: C40.2 IC14.5(IN+) R?#2.1 R?#3.2
NetD51_1: D51.1(C) R50.1 T8.1(G)
NetD51_2: D51.2(A) T7.3(D)
NetIC13_2: IC13.2(COM) R34.2
NetIC14_2: IC14.2(IN-) IC14.6(IN-) R34.1 U1.1(OUT)
NetIC14_7: IC14.7(OUT) IC16.1(CK) R42.1 R?#2.2
NetIC15_3: IC15.3(~{Q}) LD3.2(A)
NetIC15_6: IC15.6(~{CLR}) PB4.3 PB4.4 R44.2 R46.1
NetIC15_7: IC15.7(~{PR}) IC16.6(~{CLR}) PB3.3 PB3.4 R43.2 R45.1
NetJ4_1: J4.1 T8.4(D)
NetLD3_1: LD3.1(C) R47.2
NetLD4_1: LD4.1(C) R48.2
NetLD5_1: LD5.1(C) R49.2
NetR31_2: R31.2 R50.2 T8.3(S) U1.5(VIN+)

Not connected (* = marked no-connect by the designer): IC15 4(GND) 8(VCC); IC16 3(~{Q}) 4(GND) 8(VCC)